# EasyEDA schematic FAR LR1 Remote Recovery Schematic EasyEDA.json
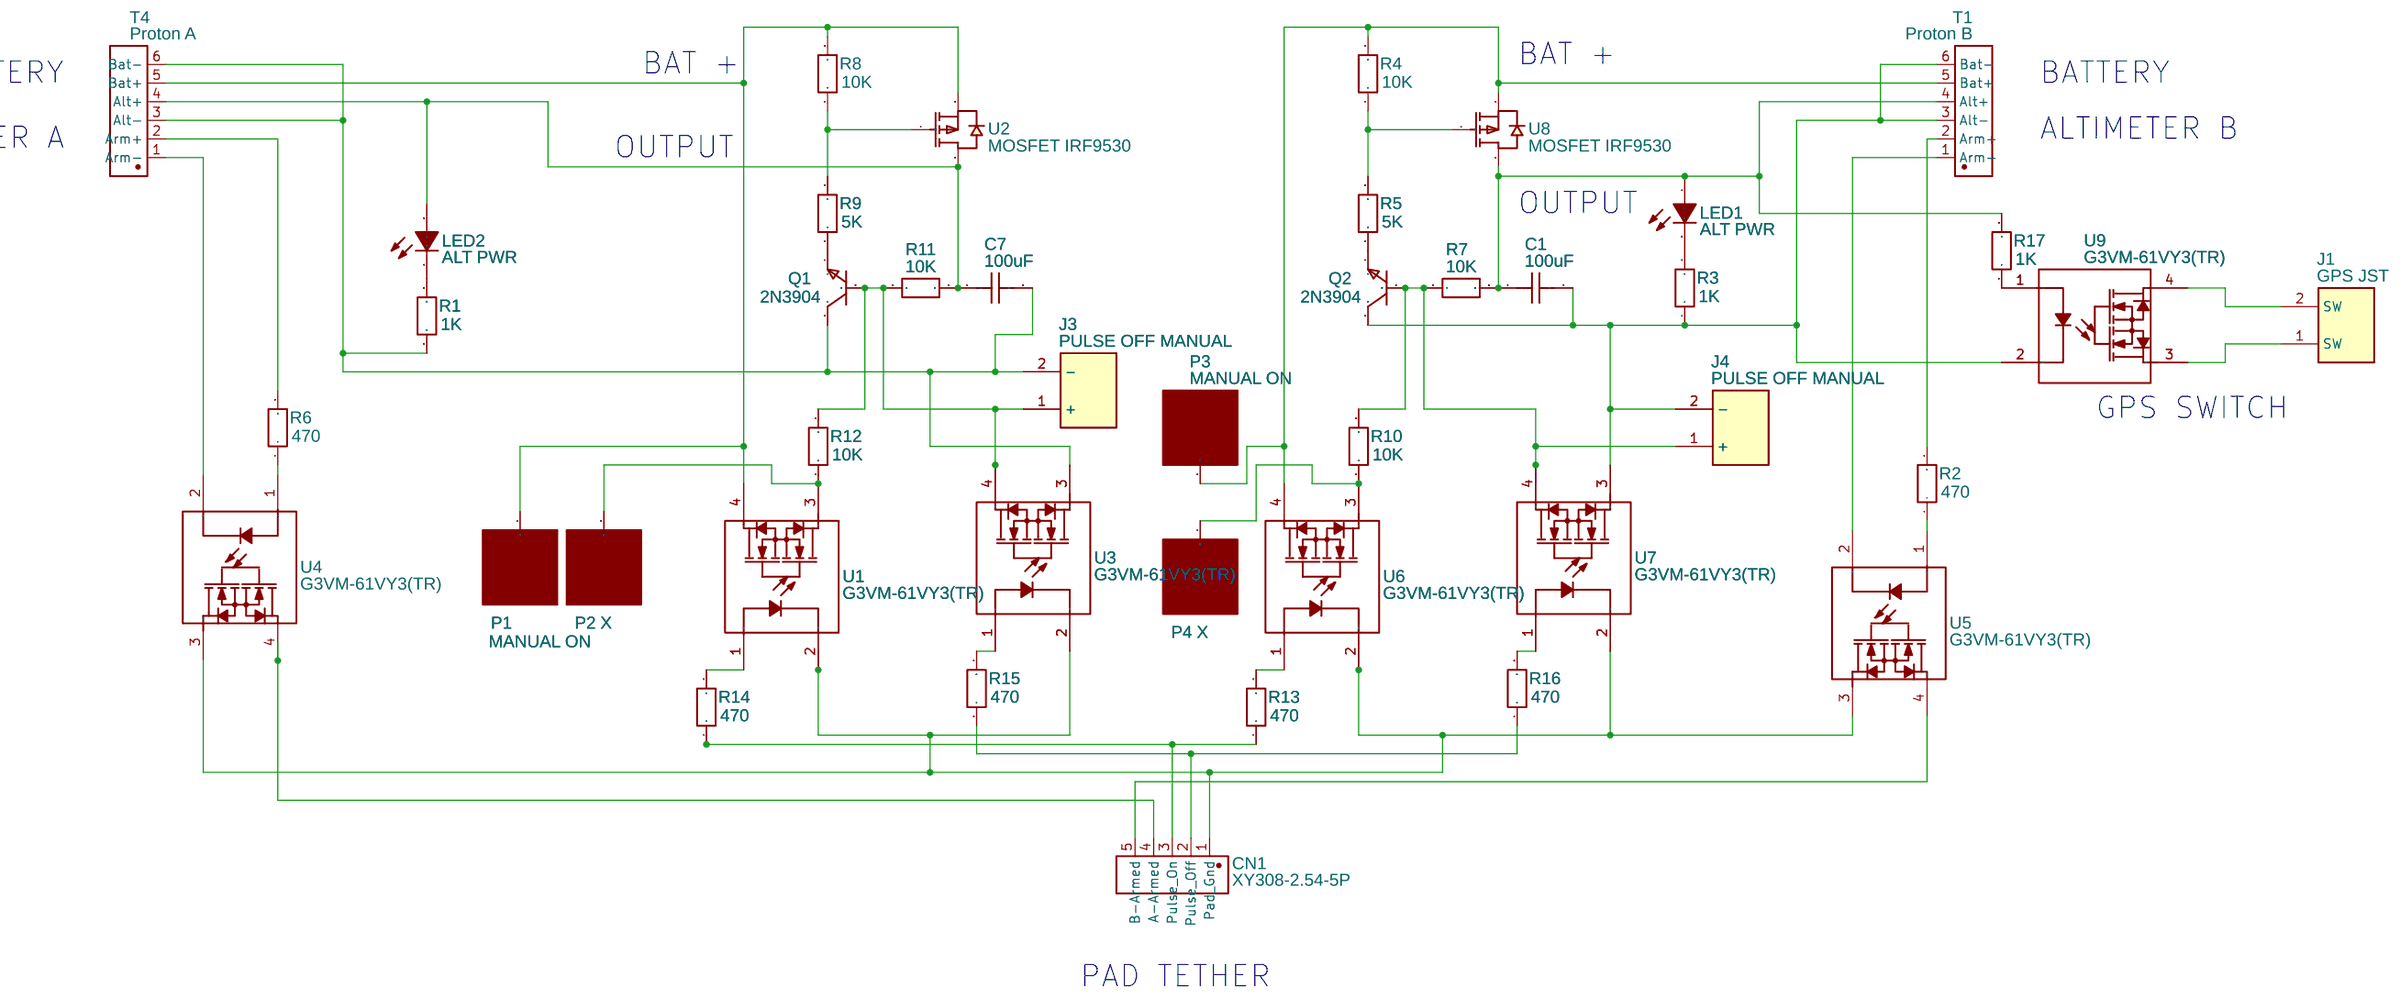
[diagram p0: schematic sheet]

## Parts
C1  100uF  [C1206]
C7  100uF  [C1206]
CN1  XY308-2.54-5P  [CONN-TH_XY308-2.54-5P]
J1  GPS JST  [CONN-TH_B2B-PH-K-S]
J3  PULSE OFF MANUAL  [CONN-TH_B2B-PH-K-S]
J4  PULSE OFF MANUAL  [CONN-TH_B2B-PH-K-S]
LED1  ALT PWR  [LED-SMD_L3.5-W2.8-R-RD]
LED2  ALT PWR  [LED-SMD_L3.5-W2.8-R-RD]
P1  MANUAL ON  [PAD_1.5X2.5]
P2  X  [PAD_1.5X2.5]
P3  MANUAL ON  [PAD_1.5X2.5]
P4  X  [PAD_1.5X2.5]
Q1  2N3904  [TO-92-3_L4.6-W3.6-P1.30-L_2N3904]
Q2  2N3904  [TO-92-3_L4.6-W3.6-P1.30-L_2N3904]
R1  1K  [R0603]
R2  470  [R0603]
R3  1K  [R0603]
R4  10K  [R0603]
R5  5K  [R0603]
R6  470  [R0603]
R7  10K  [R0603]
R8  10K  [R0603]
R9  5K  [R0603]
R10  10K  [R0603]
R11  10K  [R0603]
R12  10K  [R0603]
R13  470  [R0603]
R14  470  [R0603]
R15  470  [R0603]
R16  470  [R0603]
R17  1K  [R0603]
T1  Proton B  [CONN-TH_DB125-2.54-6P-GN]
T4  Proton A  [CONN-TH_DB125-2.54-6P-GN]
U1  G3VM-61VY3(TR)  [SOP-4_L3.9-W4.4-P2.54-LS7.0-BR]
U2  MOSFET IRF9530  [TO-220AB-3_L10.3-W5.0-P2.54-L]
U3  G3VM-61VY3(TR)  [SOP-4_L3.9-W4.4-P2.54-LS7.0-BR]
U4  G3VM-61VY3(TR)  [SOP-4_L3.9-W4.4-P2.54-LS7.0-BR]
U5  G3VM-61VY3(TR)  [SOP-4_L3.9-W4.4-P2.54-LS7.0-BR]
U6  G3VM-61VY3(TR)  [SOP-4_L3.9-W4.4-P2.54-LS7.0-BR]
U7  G3VM-61VY3(TR)  [SOP-4_L3.9-W4.4-P2.54-LS7.0-BR]
U8  MOSFET IRF9530  [TO-220AB-3_L10.3-W5.0-P2.54-L]
U9  G3VM-61VY3(TR)  [SOP-4_L3.9-W4.4-P2.54-LS7.0-BR]

## Library data of the parts
C1 C7 = GRM31CR61A107MEA8L: Supplier: LCSC; Supplier Part: C883598; Manufacturer: muRata(村田); Contributor: lcsc; JLCPCB Part Class: Extended Part
CN1 = XY308-2.54-5P: Supplier: LCSC; Supplier Part: C915914; Manufacturer: XINLAIYA(新莱亚); Contributor: LCSC; JLCPCB Part Class: Extended Part
J1 J3 J4 = B2B-PH-K-S(LF)(SN): Supplier: LCSC; Manufacturer: JST; Contributor: LCSC; Supplier Part: C131337
LED1 LED2 = 67-21/R6C-FN2Q1BZ/2T: Supplier: LCSC; Manufacturer: EVERLIGHT; image: //image.lceda.cn/szlcsc/C74350.jpg; Supplier Part: C74350; SMT Type: Extend; JLCPCB SMD: Yes; LCSC Assembly: Yes; Paste Type: expand
P1-P4 = Solder Pad: Manufacturer Part: Soldering pad; Supplier Part: undefined; Contributor: Michael Gronlund
Q1 Q2 = 2N3904_C2874602: Supplier: LCSC; Supplier Part: C2874602; Manufacturer: JSMSEMI(杰盛微); Contributor: LCSC; JLCPCB Part Class: Extended Part
R1-R17 = SFR03EZPF1001: Supplier: LCSC; Supplier Part: C2941038; Manufacturer: ROHM(罗姆); Contributor: lcsc
T1 T4 = DB125-2.54-6P-GN: Supplier: LCSC; Supplier Part: C918124; Manufacturer: DIBO(地博电子); Contributor: LCSC
U1 U3-U7 U9 = G3VM-61VY3(TR): Supplier: LCSC; Supplier Part: C2152318; Manufacturer: OMRON(欧姆龙); Contributor: LCSC; JLCPCB Part Class: Extended Part
U2 U8 = IRF9530PBF-BE3: Supplier: LCSC; Supplier Part: C3009599; Manufacturer: VISHAY(威世); Contributor: lcsc

## Nets
Net-(C1-1): C1.1 LED1.1(A) R7.2 R17.2 T1.4(Alt+) U8.2(D)
Net-(C1-2): C1.2 J4.2(-) Q2.3(C) R3.1 T1.3(Alt-) T1.6(Bat-) U7.3 U9.2
Net-(C7-1): C7.1 LED2.1(A) R11.2 T4.4(Alt+) U2.2(D)
Net-(C7-2): C7.2 J3.2(-) Q1.3(C) R1.1 T4.3(Alt-) T4.6(Bat-) U3.3
Net-(CN1-1): CN1.1(Pad Gnd) U1.2 U3.2 U4.3 U5.3 U6.2 U7.2
Net-(CN1-2): CN1.2(Pulse Off) R15.1 R16.1
Net-(CN1-3): CN1.3(Pulse On) R13.1 R14.1
Net-(CN1-4): CN1.4(A-Armed) U4.4
Net-(CN1-5): CN1.5(B-Armed) U5.4
Net-(J1-1): J1.1(SW) U9.3
Net-(J1-2): J1.2(SW) U9.4
Net-(J3-1): J3.1(+) Q1.2(B) R11.1 R12.2 U3.4
Net-(J4-1): J4.1(+) Q2.2(B) R7.1 R10.2 U7.4
Net-(LED1-2): LED1.2(C) R3.2
Net-(LED2-2): LED2.2(C) R1.2
Net-(P1-1): P1.1 R8.2 T4.5(Bat+) U1.4 U2.3(S)
Net-(P2-1): P2.1 R12.1 U1.3
Net-(P3-1): P3.1 R4.2 T1.5(Bat+) U6.4 U8.3(S)
Net-(P4-1): P4.1 R10.1 U6.3
Net-(Q1-1): Q1.1(E) R9.1
Net-(Q2-1): Q2.1(E) R5.1
Net-(R2-1): R2.1 U5.1
Net-(R2-2): R2.2 T1.2(Arm+)
Net-(R4-1): R4.1 R5.2 U8.1(G)
Net-(R6-1): R6.1 U4.1
Net-(R6-2): R6.2 T4.2(Arm+)
Net-(R8-1): R8.1 R9.2 U2.1(G)
Net-(R13-2): R13.2 U6.1
Net-(R14-2): R14.2 U1.1
Net-(R15-2): R15.2 U3.1
Net-(R16-2): R16.2 U7.1
Net-(R17-1): R17.1 U9.1
Net-(T1-1): T1.1(Arm-) U5.2
Net-(T4-1): T4.1(Arm-) U4.2

## Notes on the sheet
- BAT +
- BAT +
- BATTERY
- BATTERY
- ALTIMETER B
- ALTIMETER A
- OUTPUT
- OUTPUT
- GPS SWITCH
- PAD TETHER
- *Make sure grounds are isolated for 3 circuits
